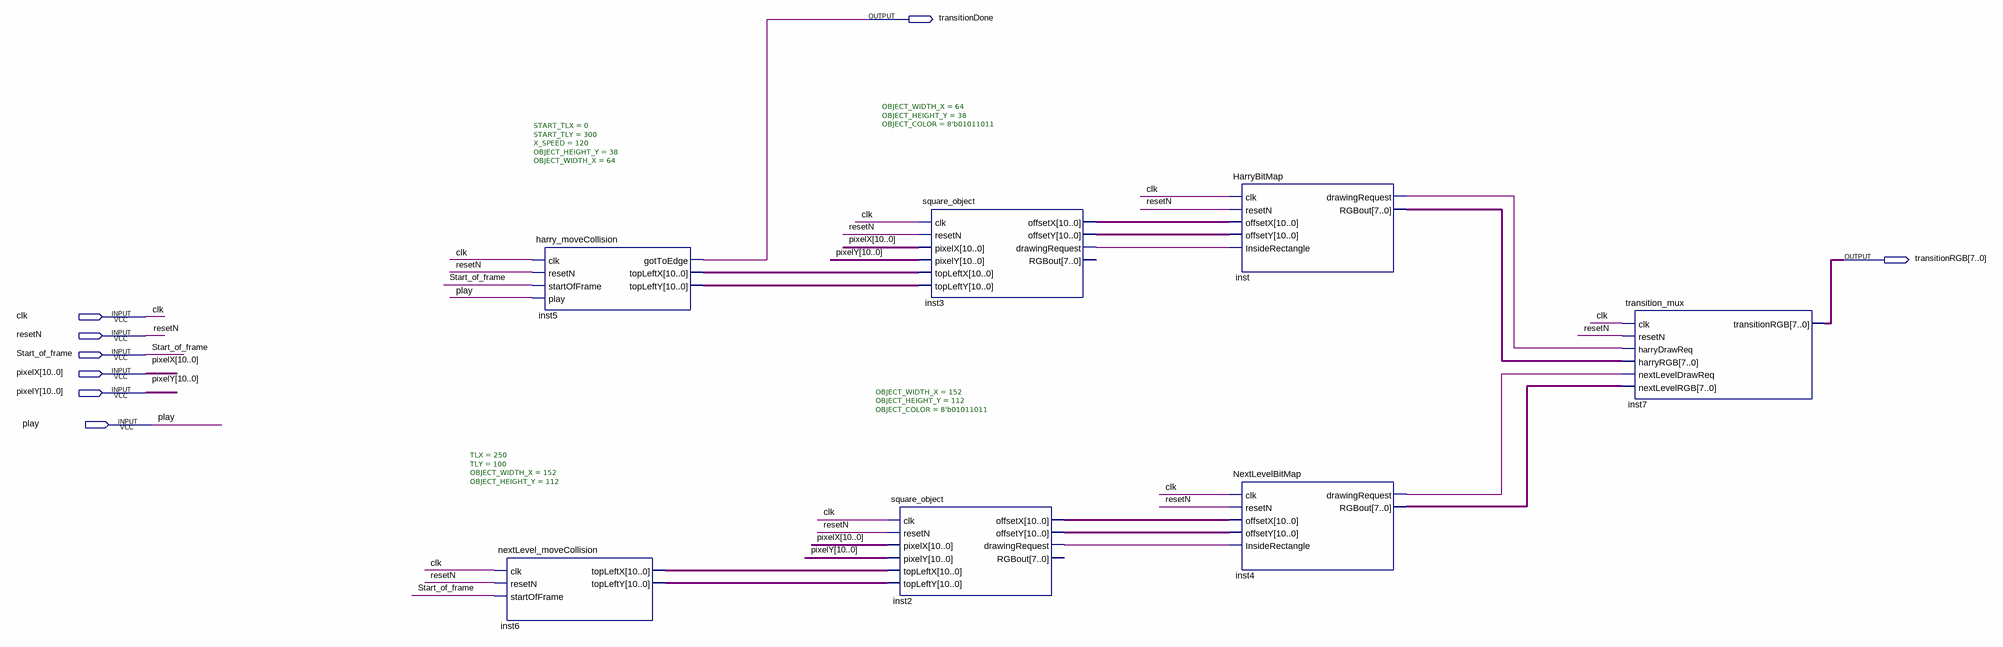
[diagram p0: schematic sheet]
// Quartus schematic TOP_TRANSITION.bdf as structural Verilog: 7 symbols, 8 pins
module TOP_TRANSITION (
  input  clk,
  input  resetN,
  input  Start_of_frame,
  input  [10:0] pixelX,
  input  [10:0] pixelY,
  input  play,
  output transitionDone,
  output [7:0] transitionRGB
);

  wire inst2_drawingrequest, inst3_drawingrequest, inst4_drawingrequest, inst_drawingrequest;
  wire [7:0] inst4_rgbout, inst_rgbout;
  wire [10:0] inst2_offsetx, inst2_offsety, inst3_offsetx, inst3_offsety, inst5_topleftx, inst5_toplefty,
       inst6_topleftx, inst6_toplefty;

  nextLevel_moveCollision #(.TLX(250), .TLY(100), .OBJECT_WIDTH_X(152), .OBJECT_HEIGHT_Y(112)) inst6 (
    .clk(clk), .resetN(resetN), .startOfFrame(Start_of_frame), .topLeftX(inst6_topleftx),
    .topLeftY(inst6_toplefty));
  harry_moveCollision #(.START_TLX(0), .START_TLY(300), .X_SPEED(120), .OBJECT_HEIGHT_Y(38), .OBJECT_WIDTH_X(64)) inst5 (
    .clk(clk), .resetN(resetN), .startOfFrame(Start_of_frame), .play(play), .gotToEdge(transitionDone),
    .topLeftX(inst5_topleftx), .topLeftY(inst5_toplefty));
  square_object #(.OBJECT_WIDTH_X(64), .OBJECT_HEIGHT_Y(38), .OBJECT_COLOR(8'b01011011)) inst3 (
    .clk(clk), .resetN(resetN), .pixelX(pixelX), .pixelY(pixelY), .topLeftX(inst5_topleftx),
    .topLeftY(inst5_toplefty), .offsetX(inst3_offsetx), .offsetY(inst3_offsety),
    .drawingRequest(inst3_drawingrequest));  // open: RGBout
  square_object #(.OBJECT_WIDTH_X(152), .OBJECT_HEIGHT_Y(112), .OBJECT_COLOR(8'b01011011)) inst2 (
    .clk(clk), .resetN(resetN), .pixelX(pixelX), .pixelY(pixelY), .topLeftX(inst6_topleftx),
    .topLeftY(inst6_toplefty), .offsetX(inst2_offsetx), .offsetY(inst2_offsety),
    .drawingRequest(inst2_drawingrequest));  // open: RGBout
  HarryBitMap inst (
    .clk(clk), .resetN(resetN), .offsetX(inst3_offsetx), .offsetY(inst3_offsety),
    .InsideRectangle(inst3_drawingrequest), .drawingRequest(inst_drawingrequest), .RGBout(inst_rgbout));
  NextLevelBitMap inst4 (
    .clk(clk), .resetN(resetN), .offsetX(inst2_offsetx), .offsetY(inst2_offsety),
    .InsideRectangle(inst2_drawingrequest), .drawingRequest(inst4_drawingrequest), .RGBout(inst4_rgbout));
  transition_mux inst7 (
    .clk(clk), .resetN(resetN), .harryDrawReq(inst_drawingrequest), .harryRGB(inst_rgbout),
    .nextLevelDrawReq(inst4_drawingrequest), .nextLevelRGB(inst4_rgbout), .transitionRGB(transitionRGB));
endmodule
